# EAGLE design badge Rev B (EAGLE 7.7.0)

## Sheet 1 of 2
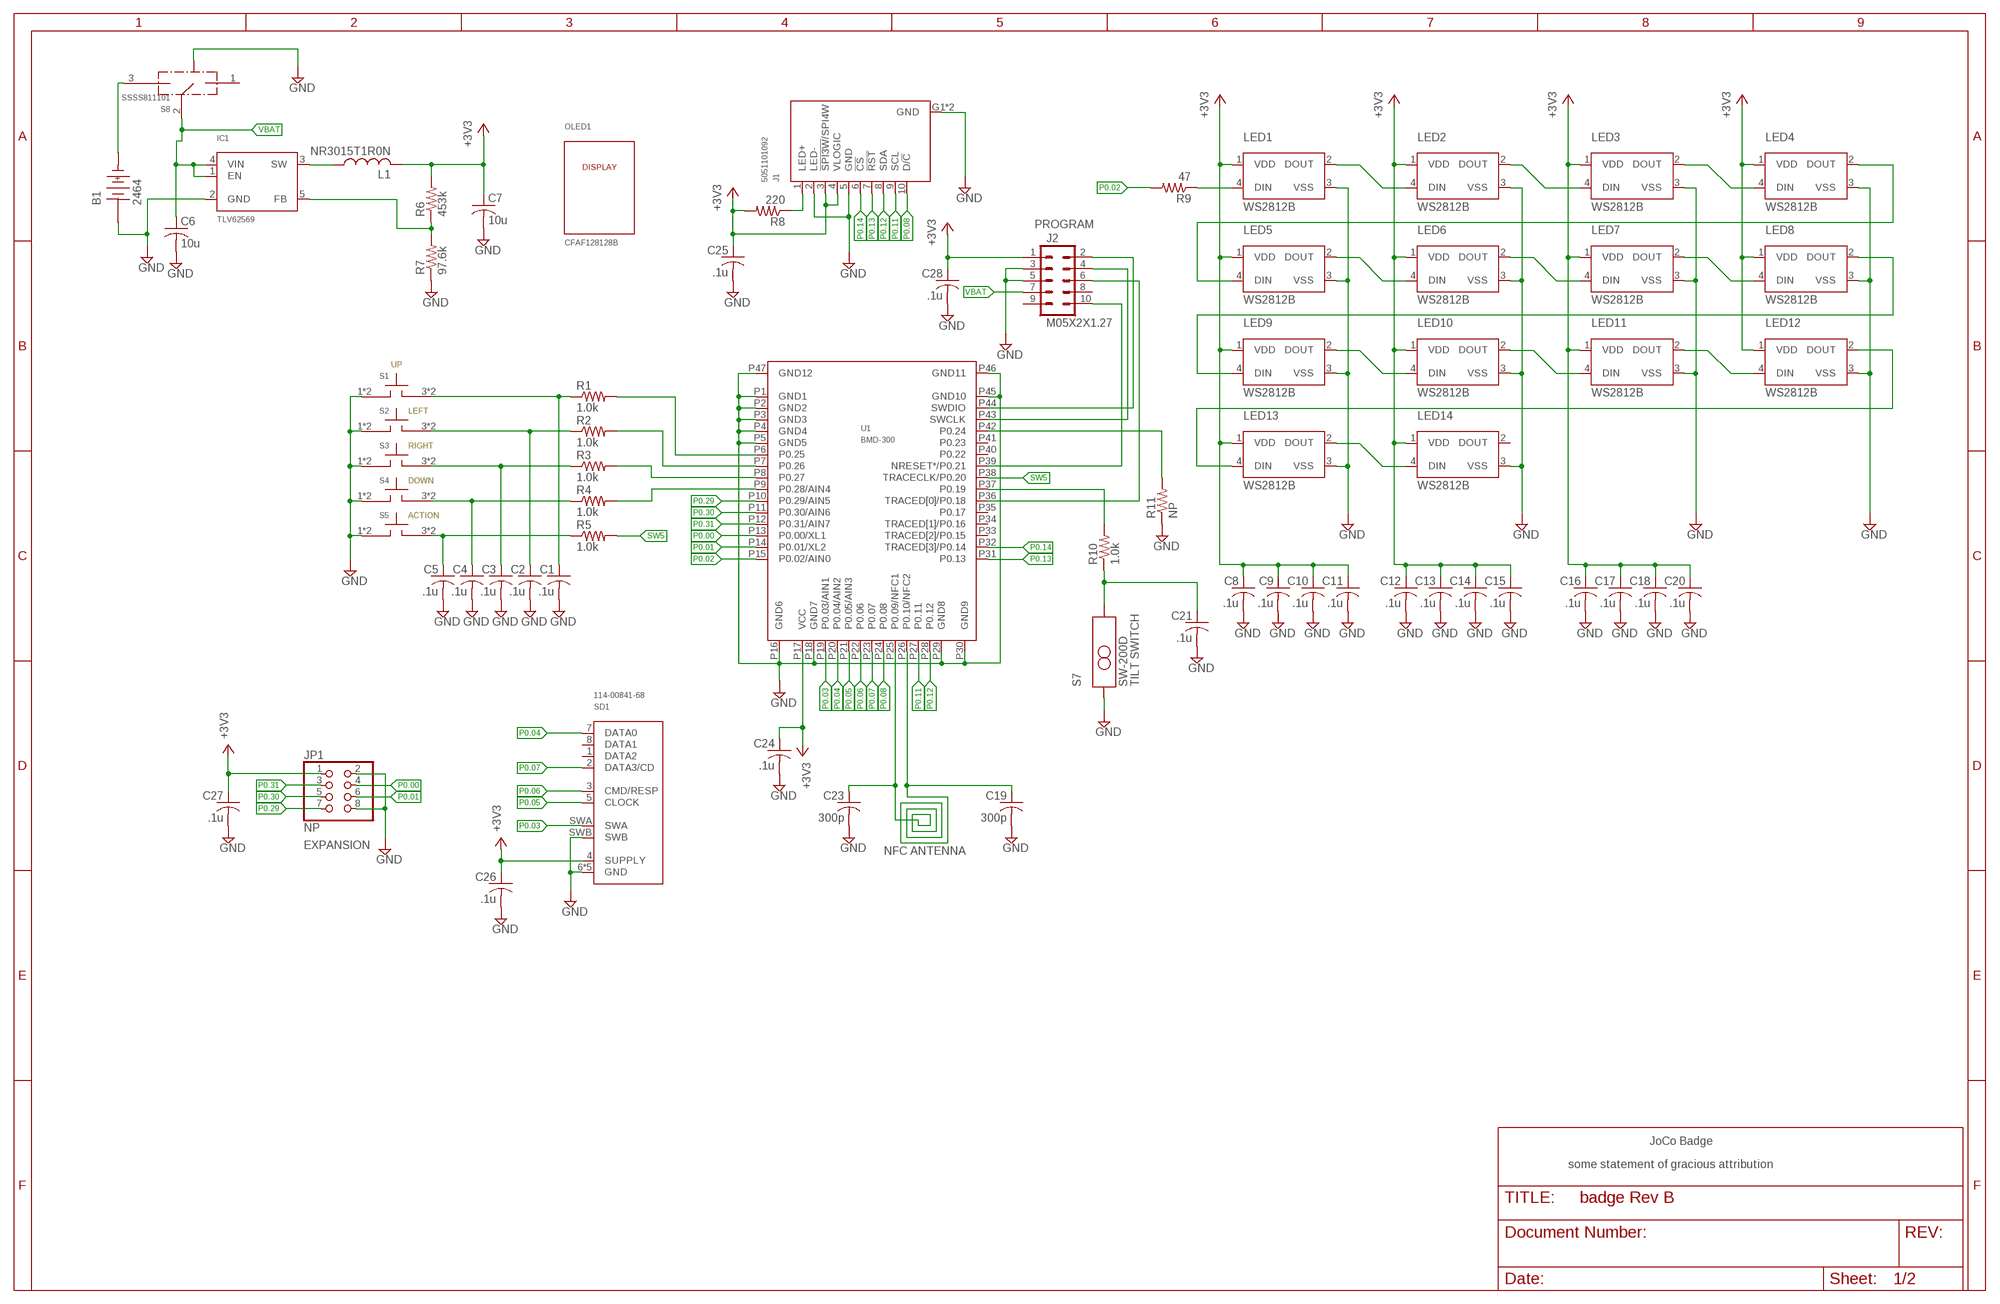
[diagram p0: schematic, sheet 1]

### Parts
B1  2464  [2464]
C1  .1u  C-USC0402K  [C0402K]
C2  .1u  C-USC0402K  [C0402K]
C3  .1u  C-USC0402K  [C0402K]
C4  .1u  C-USC0402K  [C0402K]
C5  .1u  C-USC0402K  [C0402K]
C6  10u  C-USC0805K  [C0805K]
C7  10u  C-USC0805K  [C0805K]
C8  .1u  C-USC0402K  [C0402K]
C9  .1u  C-USC0402K  [C0402K]
C10  .1u  C-USC0402K  [C0402K]
C11  .1u  C-USC0402K  [C0402K]
C12  .1u  C-USC0402K  [C0402K]
C13  .1u  C-USC0402K  [C0402K]
C14  .1u  C-USC0402K  [C0402K]
C15  .1u  C-USC0402K  [C0402K]
C16  .1u  C-USC0402K  [C0402K]
C17  .1u  C-USC0402K  [C0402K]
C18  .1u  C-USC0402K  [C0402K]
C19  300p  C-USC0603K  [C0603K]
C20  .1u  C-USC0402K  [C0402K]
C21  .1u  C-USC0402K  [C0402K]
C23  300p  C-USC0603K  [C0603K]
C24  .1u  C-USC0402K  [C0402K]
C25  .1u  C-USC0402K  [C0402K]
C26  .1u  C-USC0402K  [C0402K]
C27  .1u  C-USC0402K  [C0402K]
C28  .1u  C-USC0402K  [C0402K]
IC1  TLV62569  [DBV-5]
J1  5051101092  [5051101092]
J2  M05X2X1.27  [2X5X1.27]
JP1  NP  PINHD-2X4  [2X04]
L1  NR3015T1R0N  NR3015  [NR3015]
LED1  WS2812B  [WS2812B]
LED2  WS2812B  [WS2812B]
LED3  WS2812B  [WS2812B]
LED4  WS2812B  [WS2812B]
LED5  WS2812B  [WS2812B]
LED6  WS2812B  [WS2812B]
LED7  WS2812B  [WS2812B]
LED8  WS2812B  [WS2812B]
LED9  WS2812B  [WS2812B]
LED10  WS2812B  [WS2812B]
LED11  WS2812B  [WS2812B]
LED12  WS2812B  [WS2812B]
LED13  WS2812B  [WS2812B]
LED14  WS2812B  [WS2812B]
OLED1  CFAF128128B  [CFAF128128B]
R1  1.0k  R-US_R0603  [R0603]
R2  1.0k  R-US_R0603  [R0603]
R3  1.0k  R-US_R0603  [R0603]
R4  1.0k  R-US_R0603  [R0603]
R5  1.0k  R-US_R0603  [R0603]
R6  453k  R-US_R0603  [R0603]
R7  97.6k  R-US_R0603  [R0603]
R8  220  R-US_R0603  [R0603]
R9  47  R-US_R0603  [R0603]
R10  1.0k  R-US_R0603  [R0603]
R11  NP  R-US_R0805  [R0805]
S1  PTS810  [PTS810]
S2  PTS810  [PTS810]
S3  PTS810  [PTS810]
S4  PTS810  [PTS810]
S5  PTS810  [PTS810]
S7  SW-200D  [SW-200D]
S8  SSSS811101  [SSSS811101]
SD1  114-00841-68  [114-00841-68]
U1  BMD-300  [BMD-300]

### Nets
!RESET: J2.10 U1.P39(NRESET*/P0.21)
+3V3: C7.1 C8.1 C9.1 C10.1 C11.1 C12.1 C13.1 C14.1 C15.1 C16.1 C17.1 C18.1 C20.1 C24.1 C25.1 C26.1 C27.1 C28.1 J1.3(!SPI3W!/SPI4W) J1.4(VLOGIC) J2.1 JP1.1 L1.2 LED1.1(VDD) LED2.1(VDD) LED3.1(VDD) LED4.1(VDD) LED5.1(VDD) LED6.1(VDD) LED7.1(VDD) LED8.1(VDD) LED9.1(VDD) LED10.1(VDD) LED11.1(VDD) LED12.1(VDD) LED13.1(VDD) LED14.1(VDD) R6.2 R8.2 SD1.4(SUPPLY) U1.P17(VCC)
ANT: C19.1 C23.1 U1.P25(P0.09/NFC1) U1.P26(P0.10/NFC2)
FB: IC1.5(FB) R6.1 R7.2
GND: B1.- C1.2 C2.2 C3.2 C4.2 C5.2 C6.2 C7.2 C8.2 C9.2 C10.2 C11.2 C12.2 C13.2 C14.2 C15.2 C16.2 C17.2 C18.2 C19.2 C20.2 C21.2 C23.2 C24.2 C25.2 C26.2 C27.2 C28.2 IC1.2(GND) J1.2(LED-) J1.5(GND) J1.G1(GND) J1.G2(GND) J2.3 J2.5 JP1.2 JP1.8 LED1.3(VSS) LED2.3(VSS) LED3.3(VSS) LED4.3(VSS) LED5.3(VSS) LED6.3(VSS) LED7.3(VSS) LED8.3(VSS) LED9.3(VSS) LED10.3(VSS) LED11.3(VSS) LED12.3(VSS) LED13.3(VSS) LED14.3(VSS) R7.1 R11.1 S1.1(A) S1.2(A) S2.1(A) S2.2(A) S3.1(A) S3.2(A) S4.1(A) S4.2(A) S5.1(A) S5.2(A) S7.A S8.G1(GND) S8.G2(GND) S8.G3(GND) S8.G4(GND) SD1.6(GND) SD1.G1(GND) SD1.G2(GND) SD1.G3(GND) SD1.G4(GND) SD1.SWB U1.P1(GND1) U1.P2(GND2) U1.P3(GND3) U1.P4(GND4) U1.P5(GND5) U1.P16(GND6) U1.P18(GND7) U1.P29(GND8) U1.P30(GND9) U1.P45(GND10) U1.P46(GND11) U1.P47(GND12)
N$1: C1.1 R1.1 S1.3(B) S1.4(B)
N$2: C2.1 R2.1 S2.3(B) S2.4(B)
N$3: C3.1 R3.1 S3.3(B) S3.4(B)
N$4: C4.1 R4.1 S4.3(B) S4.4(B)
N$5: C5.1 R5.1 S5.3(B) S5.4(B)
N$6: R1.2 U1.P6(P0.25)
N$7: R2.2 U1.P7(P0.26)
N$8: R3.2 U1.P8(P0.27)
N$9: R4.2 U1.P9(P0.28/AIN4)
N$10: R11.2 U1.P42(P0.24)
N$11: C21.1 R10.1 S7.C
N$13: J1.1(LED+) R8.1
N$15: LED5.2(DOUT) LED6.4(DIN)
N$16: LED9.2(DOUT) LED10.4(DIN)
N$17: LED13.2(DOUT) LED14.4(DIN)
N$18: LED1.2(DOUT) LED2.4(DIN)
N$19: LED6.2(DOUT) LED7.4(DIN)
N$20: LED10.2(DOUT) LED11.4(DIN)
N$22: LED3.2(DOUT) LED4.4(DIN)
N$23: LED7.2(DOUT) LED8.4(DIN)
N$24: LED2.2(DOUT) LED3.4(DIN)
N$25: LED11.2(DOUT) LED12.4(DIN)
N$27: LED4.2(DOUT) LED5.4(DIN)
N$28: LED8.2(DOUT) LED9.4(DIN)
N$29: LED12.2(DOUT) LED13.4(DIN)
N$30: LED1.4(DIN) R9.1
P0.00: JP1.4 U1.P13(P0.00/XL1)
P0.01: JP1.6 U1.P14(P0.01/XL2)
P0.02: R9.2 U1.P15(P0.02/AIN0)
P0.03: SD1.SWA U1.P19(P0.03/AIN1)
P0.04: SD1.7(DATA0) U1.P20(P0.04/AIN2)
P0.05: SD1.5(CLOCK) U1.P21(P0.05/AIN3)
P0.06: SD1.3(CMD/RESP) U1.P22(P0.06)
P0.07: SD1.2(DATA3/CD) U1.P23(P0.07)
P0.08: J1.10(D/!C) U1.P24(P0.08)
P0.11: J1.9(SCL) U1.P27(P0.11)
P0.12: J1.8(SDA) U1.P28(P0.12)
P0.13: J1.7(!RST) U1.P31(P0.13)
P0.14: J1.6(!CS) U1.P32(TRACED[3]/P0.14)
P0.18: J2.6 U1.P36(TRACED[0]/P0.18)
P0.19: R10.2 U1.P37(P0.19)
P0.29: JP1.7 U1.P10(P0.29/AIN5)
P0.30: JP1.5 U1.P11(P0.30/AIN6)
P0.31: JP1.3 U1.P12(P0.31/AIN7)
SW: IC1.3(SW) L1.1
SW5: R5.2 U1.P38(TRACECLK/P0.20)
SWCLK: J2.4 U1.P43(SWCLK)
SWDIO: J2.2 U1.P44(SWDIO)
VBAT: C6.1 IC1.1(EN) IC1.4(VIN) J2.7 S8.2
VIN: B1.+ S8.3
Unconnected: J2.8 J2.9 LED14.2(DOUT) S8.1 SD1.1(DATA2) SD1.8(DATA1) U1.P33(TRACED[2]/P0.15) U1.P34(TRACED[1]/P0.16) U1.P35(P0.17) U1.P40(P0.22) U1.P41(P0.23)

### Notes on the sheet
- PROGRAM
- UP
- LEFT
- RIGHT
- DOWN
- ACTION
- TILT SWITCH
- EXPANSION
- NFC ANTENNA
- JoCo Badge
- some statement of gracious attribution

## Sheet 2 of 2
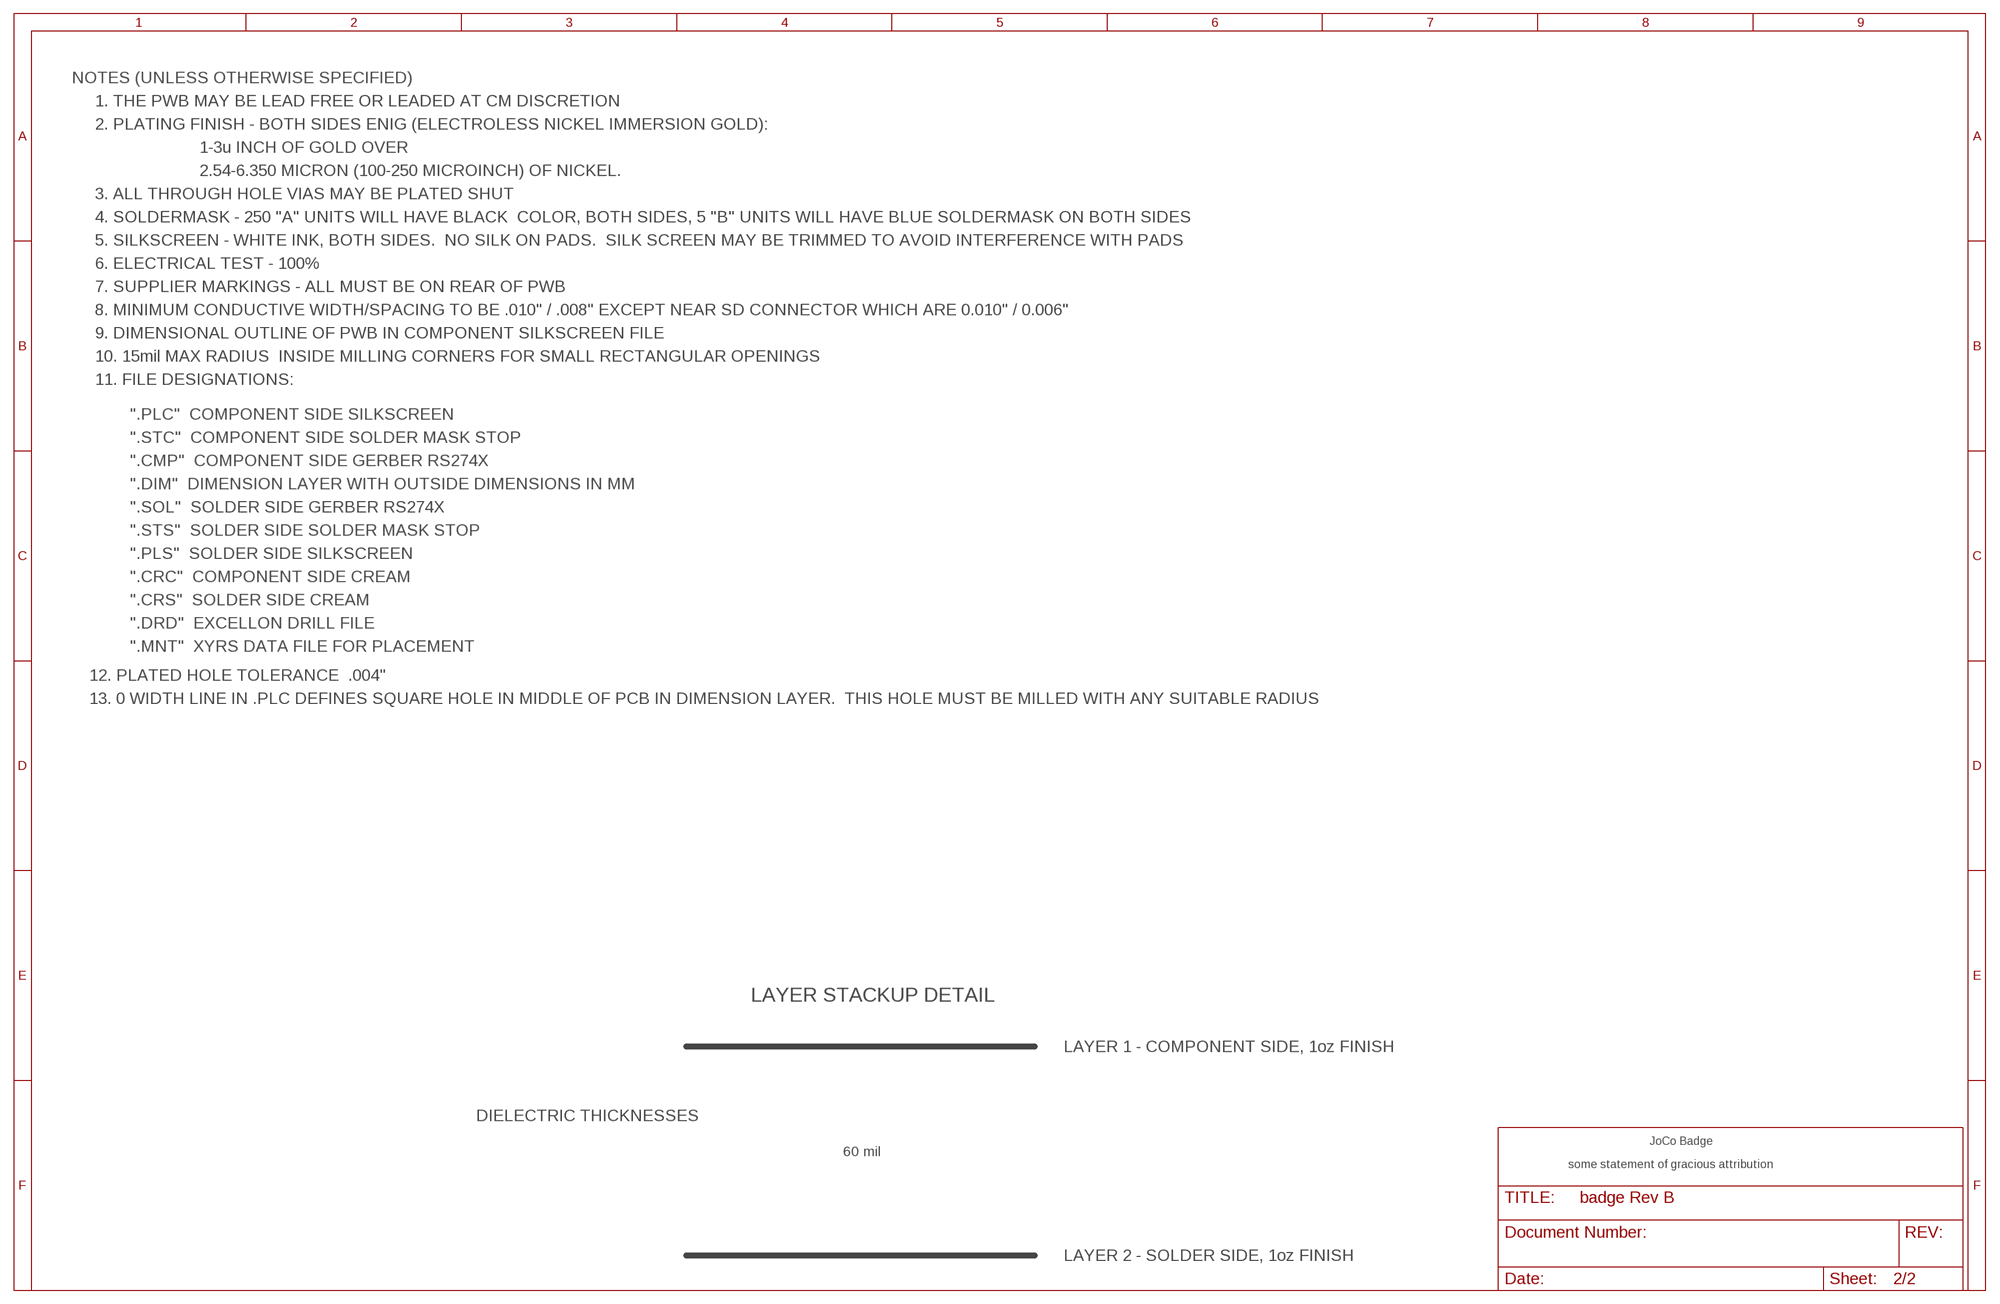
[diagram p1: schematic, sheet 2]

### Notes on the sheet
- NOTES (UNLESS OTHERWISE SPECIFIED)
- 1. THE PWB MAY BE LEAD FREE OR LEADED AT CM DISCRETION
- 2. PLATING FINISH - BOTH SIDES ENIG (ELECTROLESS NICKEL IMMERSION GOLD):
- 1-3u INCH OF GOLD OVER
- 2.54-6.350 MICRON (100-250 MICROINCH) OF NICKEL.
- 3. ALL THROUGH HOLE VIAS MAY BE PLATED SHUT
- 4. SOLDERMASK - 250 "A" UNITS WILL HAVE BLACK  COLOR, BOTH SIDES, 5 "B" UNITS WILL HAVE BLUE SOLDERMASK ON BOTH SIDES
- 5. SILKSCREEN - WHITE INK, BOTH SIDES.  NO SILK ON PADS.  SILK SCREEN MAY BE TRIMMED TO AVOID INTERFERENCE WITH PADS
- 6. ELECTRICAL TEST - 100%
- 7. SUPPLIER MARKINGS - ALL MUST BE ON REAR OF PWB
- 8. MINIMUM CONDUCTIVE WIDTH/SPACING TO BE .010" / .008" EXCEPT NEAR SD CONNECTOR WHICH ARE 0.010" / 0.006"
- 9. DIMENSIONAL OUTLINE OF PWB IN COMPONENT SILKSCREEN FILE
- 10. 15mil MAX RADIUS  INSIDE MILLING CORNERS FOR SMALL RECTANGULAR OPENINGS
- 11. FILE DESIGNATIONS:
- ".PLC"  COMPONENT SIDE SILKSCREEN
- ".STC"  COMPONENT SIDE SOLDER MASK STOP
- ".CMP"  COMPONENT SIDE GERBER RS274X
- ".DIM"  DIMENSION LAYER WITH OUTSIDE DIMENSIONS IN MM
- ".SOL"  SOLDER SIDE GERBER RS274X
- ".STS"  SOLDER SIDE SOLDER MASK STOP
- ".PLS"  SOLDER SIDE SILKSCREEN
- ".CRC"  COMPONENT SIDE CREAM
- ".CRS"  SOLDER SIDE CREAM
- ".DRD"  EXCELLON DRILL FILE
- ".MNT"  XYRS DATA FILE FOR PLACEMENT
- 12. PLATED HOLE TOLERANCE  .004"
- 13. 0 WIDTH LINE IN .PLC DEFINES SQUARE HOLE IN MIDDLE OF PCB IN DIMENSION LAYER.  THIS HOLE MUST BE MILLED WITH ANY SUITABLE RADIUS
- LAYER STACKUP DETAIL
- LAYER 1 - COMPONENT SIDE, 1oz FINISH
- DIELECTRIC THICKNESSES
- JoCo Badge
- 60 mil
- some statement of gracious attribution
- LAYER 2 - SOLDER SIDE, 1oz FINISH

## Library data of the parts
B1 = badge:2464
C1-C5 C8-C21 C23-C28 = rcl:C-US: CAPACITOR, American symbol
C6 C7 = rcl:C-US: CAPACITOR, American symbol; MPN: JMK212BJ106KD-T
IC1 = badge:TLV62569
J1 = badge:5051101092
J2 = badge:M05X2X1.27
JP1 = pinhead:PINHD-2X4: PIN HEADER
L1 = badge:NR3015
LED1-LED14 = badge:WS2812B
OLED1 = badge:CFAF128128B
R1-R11 = rcl:R-US_: RESISTOR, American symbol
S1-S5 = badge:PTS810
S7 = badge:SW-200D
S8 = badge:SSSS811101
SD1 = badge:114-00841-68
U1 = BMD-300:BMD-300

## Board
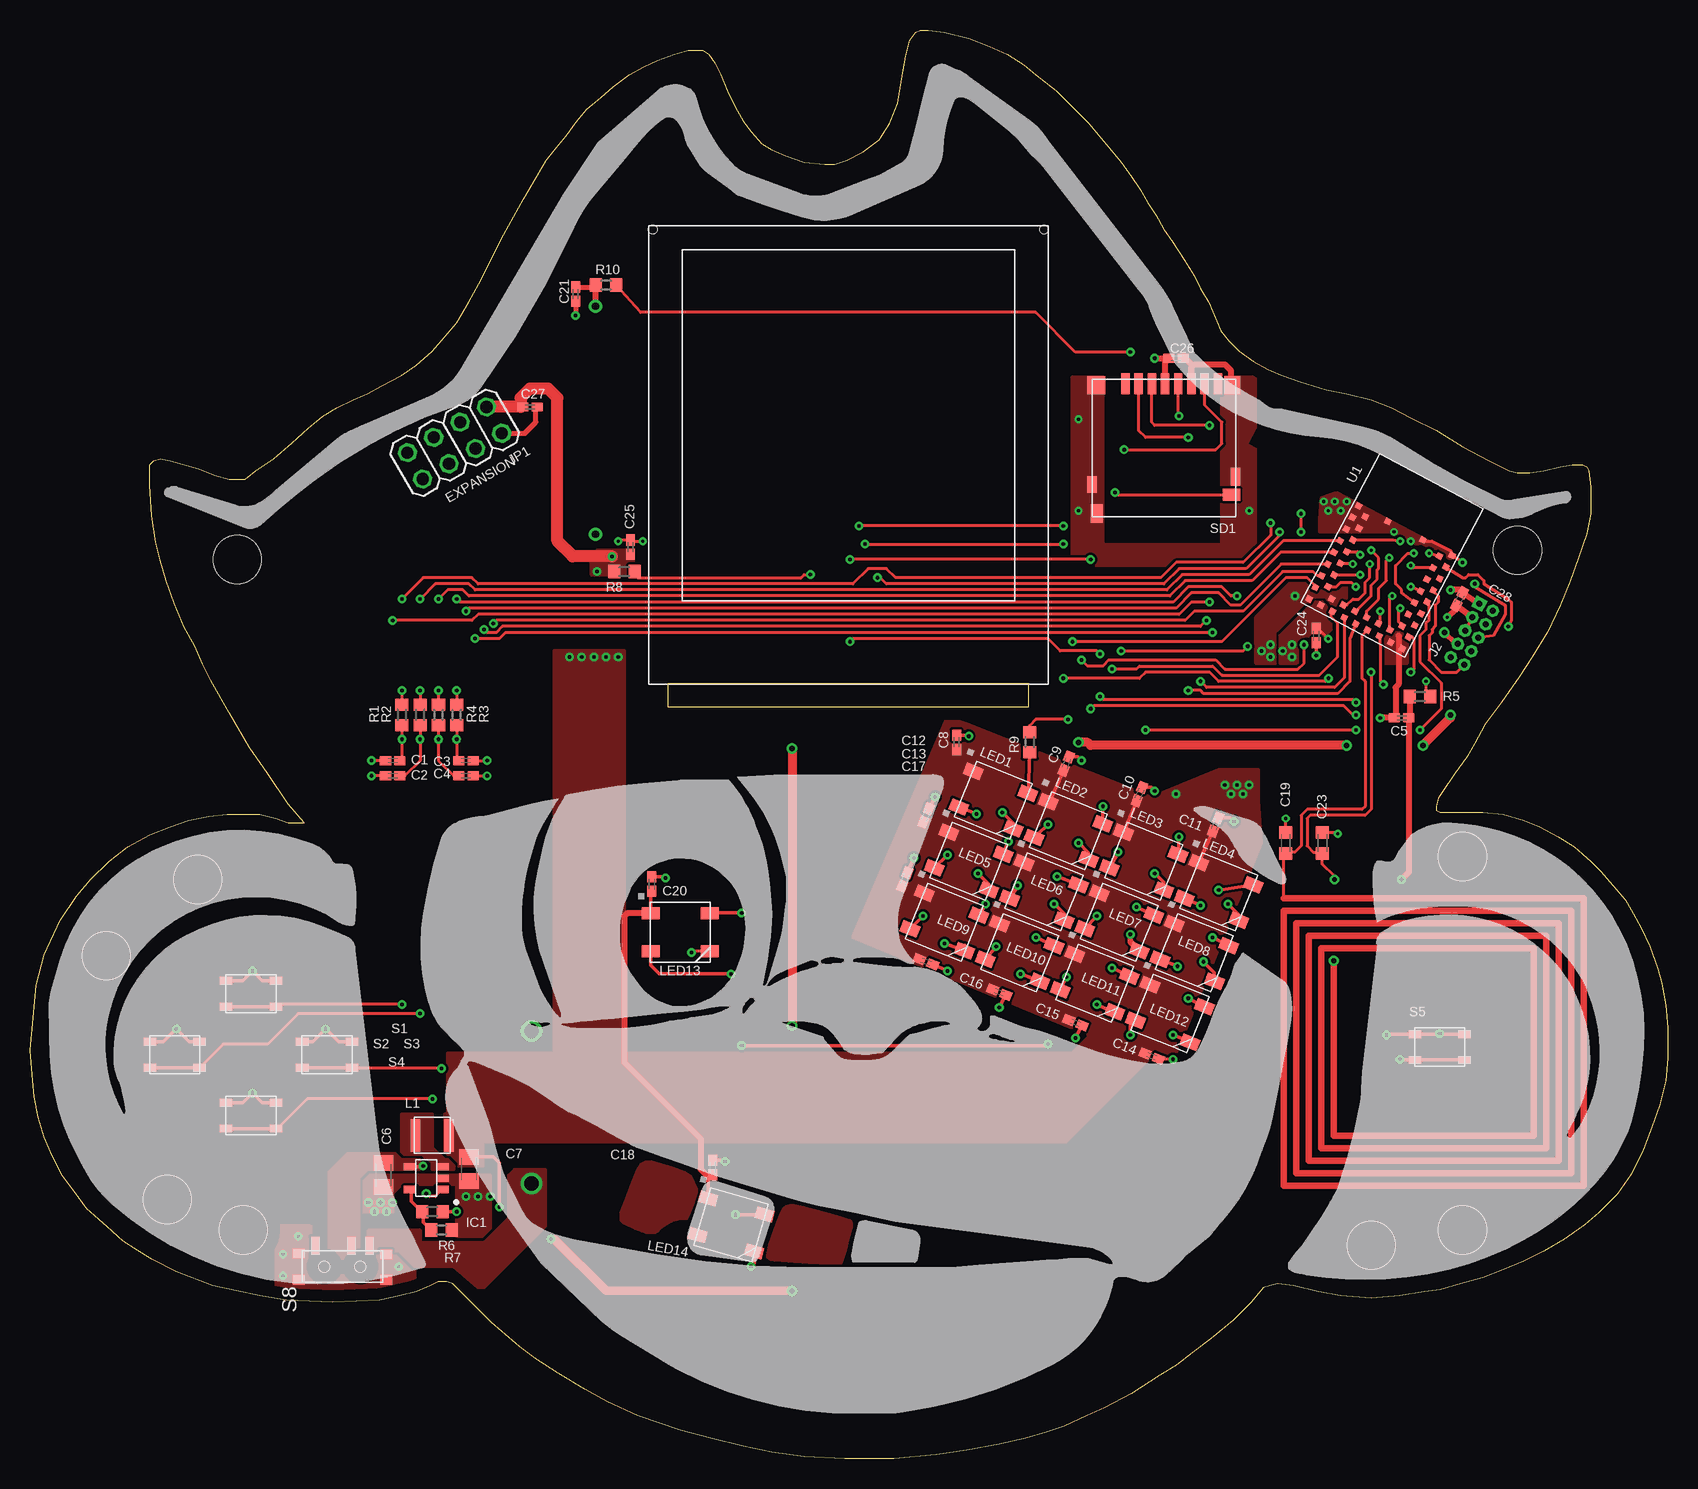
[diagram p2: board, top side]
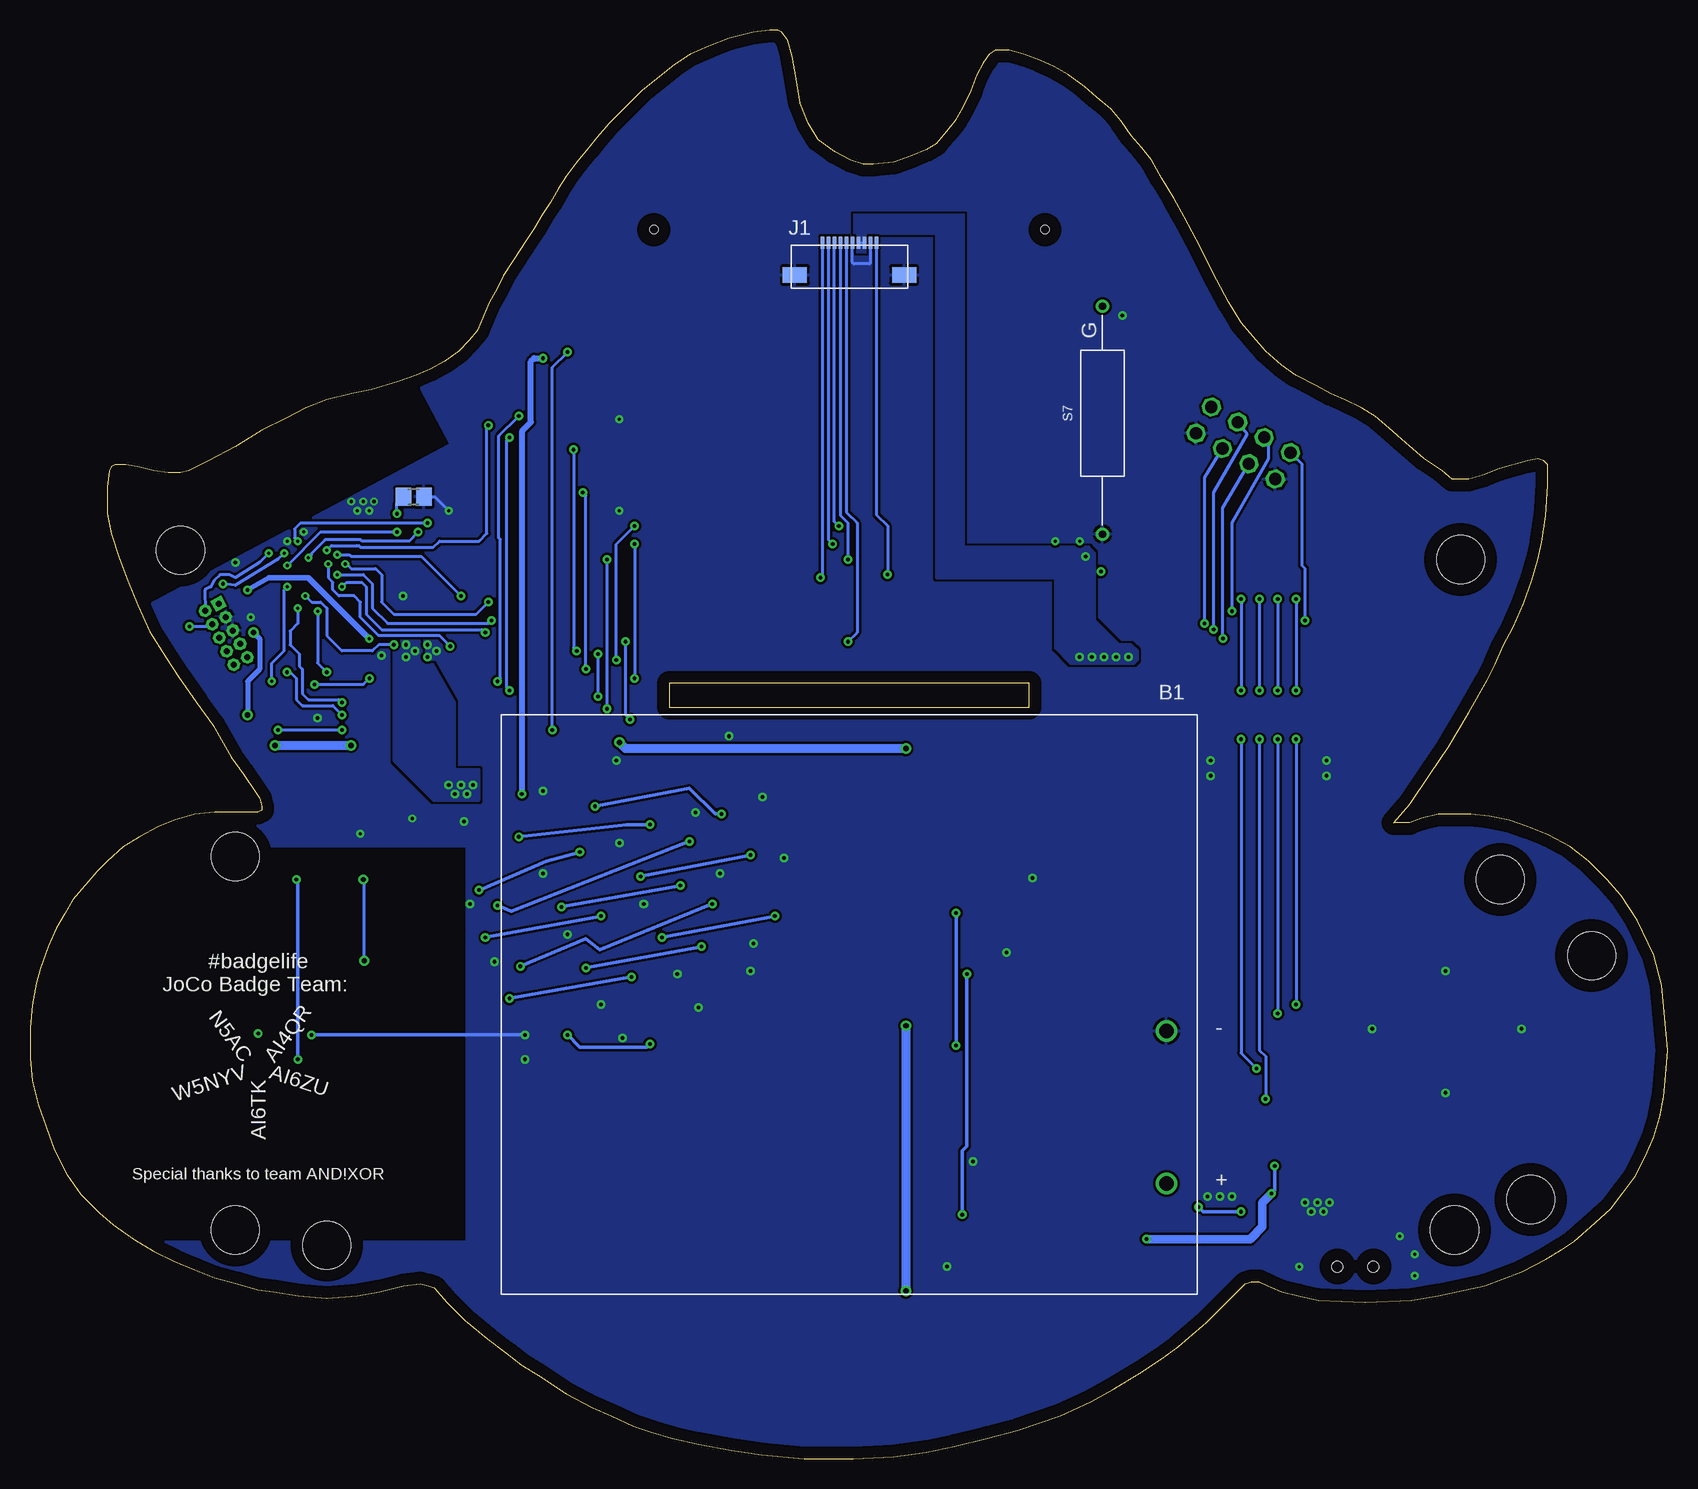
[diagram p3: board, bottom side, seen from below]

Size 136.49 x 119.05 mm. Coordinates in mm from the lower left corner, seen from the top.
Outline: 254 segments
Copper layers (1*16): Top 0.035mm / dielectric 1.5mm / Bottom 0.035mm
Design rules "default *": minimum track width 10mil, minimum drill 10mil, track to track 8mil, track to pad 8mil, pad to pad 8mil, via to via 8mil, smd to smd 8mil, copper to edge 40mil, drill to drill 8mil, minimum pad ring 10mil, minimum via ring 8mil, stop-mask expansion 10mil, vias tented up to drill 12mil, thermal gap 10mil
Holes 4 mm at 17.27,74.93 123.95,75.69 111.76,17.78 17.78,19.05 11.43,21.59 6.35,41.91 13.97,48.26 119.38,19.05 119.38,50.16

### Footprints (pad centres in the part's own frame; a part is rotated, then mirrored left to right if it is on the bottom)
2464 = drill 1.2: + 26.416,-14.922; - 26.416,-2.223
C0402K = smd 0.925 x 0.74: 1 -0.6,0; 2 0.6,0
C0805K = smd 1.3 x 1.6: 1 -1,0; 2 1,0
C0603K = smd 1.05 x 1.08: 1 -0.875,0; 2 0.875,0
DBV-5 = smd 0.6 x 1.05: 1 -0.95,-1.35; 2 0,-1.35; 3 0.95,-1.35; 4 0.95,1.35; 5 -0.95,1.35
5051101092 = smd 0.3 x 1: 1 2.25,0; 2 1.75,0; 3 1.25,0; 4 0.75,0; 5 0.25,0; 6 -0.25,0; 7 -0.75,0; 8 -1.25,0; 9 -1.75,0; 10 -2.25,0 | smd 2 x 1.3: G1 -4.55,-2.7; G2 4.55,-2.7
2X5X1.27 = drill 0.5 square: 1 0,0 | drill 0.5 octagon: 2 1.27,0; 3 0,-1.27; 4 1.27,-1.27; 5 0,-2.54; 6 1.27,-2.54; 7 0,-3.81; 8 1.27,-3.81; 9 0,-5.08; 10 1.27,-5.08
2X04 = drill 1.016 octagon: 1 -3.81,-1.27; 2 -3.81,1.27; 3 -1.27,-1.27; 4 -1.27,1.27; 5 1.27,-1.27; 6 1.27,1.27; 7 3.81,-1.27; 8 3.81,1.27
NR3015 = smd 0.8 x 2.7: 1 -1.4,0; 2 1.4,0
WS2812B = smd 1.5 x 1: 1 -2.45,1.6; 2 -2.45,-1.6; 3 2.45,-1.6; 4 2.45,1.6
CFAF128128B = hole 0.7: -16.3,16.3; 16.3,16.3
R0603 = smd 1 x 1.1: 1 -0.85,0; 2 0.85,0
R0805 = smd 1.3 x 1.5: 1 -0.85,0; 2 0.85,0
PTS810 = smd 1.05 x 0.65: 1 -2.075,1.075; 2 2.075,1.075; 3 -2.075,-1.075; 4 2.075,-1.075
SW-200D = drill 0.6: A -10.09,0; C 8.9,0
SSSS811101 = smd 0.7 x 1.5: 1 -2.25,1.75; 2 0.75,1.75; 3 2.25,1.75 | smd 1 x 0.8: G1 -3.65,1.1; G2 -3.65,-1.1; G3 3.65,1; G4 3.65,-1.1 | hole 0.9: 1.5,0; -1.5,0
114-00841-68 = smd 0.7 x 1.75: 1 3.2,0.875; 2 2.1,0.875; 3 1,0.875; 4 -0.1,0.875; 5 -1.2,0.875; 6 -2.3,0.875; 7 -3.4,0.875; 8 -4.5,0.875 | smd 1.3 x 1.5: G1 -5.7,1 | smd 1.5 x 1.5: G2 5.65,1 | smd 0.8 x 1.5: G3 -5.975,8.6 | smd 0.8 x 1.4: G4 5.975,9.25 | smd 1.45 x 1: SWA -5.625,10.1 | smd 1 x 1.55: SWB 5.575,11.675
BMD-300 = smd 0.5 x 0.5: P1 0.5,9.35; P2 1.4,8.8; P3 0.5,8.25; P4 1.4,7.7; P5 0.5,7.15; P6 1.4,6.6; P7 0.5,6.05; P8 1.4,5.5; P9 0.5,4.95; P10 1.4,4.4; P11 0.5,3.85; P12 1.4,3.3; P13 0.5,2.75; P14 1.4,2.2; P15 0.5,1.65; P16 0.5,0.55; P17 1.6,0.55; P18 2.15,1.45; P19 2.7,0.55; P20 3.25,1.45; P21 3.8,0.55; P22 4.35,1.45; P23 4.9,0.55; P24 5.45,1.45; P25 6,0.55; P26 6.55,1.45; P27 7.1,0.55; P28 7.65,1.45; P29 8.2,0.55; P30 9.3,0.55; P31 9.3,1.65; P32 8.4,2.2; P33 9.3,2.75; P34 8.4,3.3; P35 9.3,3.85; P36 8.4,4.4; P37 9.3,4.95; P38 8.4,5.5; P39 9.3,6.05; P40 8.4,6.6; P41 9.3,7.15; P42 8.4,7.7; P43 9.3,8.25; P44 8.4,8.8; P45 9.3,9.35; P46 6.55,9.35; P47 3.25,9.35

### Placement (x,y rotation side)
B1  68.2,37.85 0 bottom
C1  30.23,58.17 180 top
C2  30.23,56.9 180 top
C3  36.32,58.17 0 top
C4  36.32,56.9 0 top
C5  114.3,61.72 180 top
C6  29.46,23.62 270 top
C7  36.58,24.13 270 top
C8  77.22,59.69 90 top
C9  86.36,57.91 68 top
C10  92.46,55.37 68 top
C11  98.81,52.83 68 top
C12  74.68,53.59 68 top
C13  72.9,48.26 68 top
C14  93.47,33.53 338 top
C15  87.12,36.32 338 top
C16  80.77,38.86 338 top
C17  74.68,41.4 338 top
C18  56.9,24.26 90 top
C19  104.65,51.31 90 top
C20  51.82,47.88 90 top
C21  45.47,97.03 270 top
C23  107.7,51.31 90 top
C24  107.19,68.58 270 top
C25  50.04,75.95 90 top
C26  95.5,91.69 0 top
C27  41.67,87.63 0 top
C28  119.13,71.63 242 top
IC1  33.02,23.37 90 top
J1  68.2,101.33 0 bottom
J2  120.78,71.25 332 top
JP1  35.38,84.63 210 top
L1  33.53,26.92 0 top
LED1  80.27,54.87 338 top
LED2  86.53,52.33 338 top
LED3  92.8,49.79 338 top
LED4  99.06,47.25 338 top
LED5  78.24,49.79 338 top
LED6  84.5,47.25 338 top
LED7  90.77,44.71 338 top
LED8  97.03,42.17 338 top
LED9  76.2,44.71 338 top
LED10  82.47,42.17 338 top
LED11  88.74,39.63 338 top
LED12  95,37.09 338 top
LED13  54.19,43.86 0 top
LED14  58.42,19.47 344 top
OLED1  68.2,86.11 0 top
R1  30.99,61.98 90 top
R2  32.51,61.98 90 top
R3  35.56,61.98 90 top
R4  34.04,61.98 90 top
R5  115.82,63.5 0 top
R6  33.53,20.57 0 top
R7  34.29,19.05 180 top
R8  49.53,73.91 180 top
R9  83.31,59.69 90 top
R10  48.01,97.79 0 top
R11  104.52,80.14 180 bottom
S1  18.41,38.73 0 top
S2  12.06,33.66 0 top
S3  24.77,33.66 0 top
S4  18.41,28.57 0 top
S5  117.47,34.29 0 top
S7  47.12,87.12 90 bottom
S8  26.04,16 0 top
SD1  94.49,90.42 180 top
U1  105.9,71.38 332 top

### Tracks (layer width: path | path; a pad name or v marks a point on that pad's centre or on a via)
!RESET
  Top 0.254: U1.P39 116.95,72.28 117.35,71.88 117.35,71.37 117.09,71.12 117.09,69.34 116.84,69.09 116.84,68.83 116.59,68.58 116.59,66.55 117.6,65.53 118.88,65.53 J2.10
+3V3  (via drill 0.25, 0.3)
  Top 0.254: v108.2,68.33 107.44,69.09 107.28,69.09 C24.1
  Top 0.305: R6.2 v35.56,20.57 | v39.12,20.95 39.12,24.64 38.61,25.15 36.59,25.15 C7.1 | LED14.1 56.51,23.27 56.62,23.39 C18.1 | C9.1 84.84,54.48 LED2.1 | C10.1 LED3.1 | C11.1 LED4.1 | LED13.1 51.74,47.2 C20.1 | 106.97,68.96 C24.1
  Top 0.406: 40.89,87.64 C27.1
  Top 0.508: J2.1 C28.1 119.17,72.39 v118.36,72.39 | LED13.1 49.78,45.46 49.53,45.21 49.53,33.02 55.88,26.67 55.88,24.13 56.62,23.39 | SD1.4 94.59,91.38 94.82,91.61 | 94.82,91.61 C26.1 | v93.73,91.69 94.74,91.69 94.82,91.61
  Top 1.016: v48.51,75.18 45.21,75.18 43.94,76.45 43.94,88.39 43.18,89.15 41.66,89.15 40.89,88.39 40.89,87.64 JP1.1
  Bottom 0.254: J1.4 J1.3
  Bottom 0.305: v35.56,20.57 38.73,20.57 v39.12,20.95
  Bottom 0.457: v118.36,72.39 116.59,73.41 113.28,73.41 v108.2,68.33
  Bottom 0.508: v95.5,55.37 95.5,85.6 94.74,86.36 94.74,91.44 94.49,91.69 v93.73,91.69
  other vias: 105.16,67.82 105.16,66.8 104.39,67.31 99.57,56.13 100.58,56.13 101.6,56.13 100.08,55.37 101.09,55.37 47.24,73.91 44.96,66.8 45.97,66.8 46.99,66.8 48.01,66.8 49.02,66.8
  pour Top (rank 4, no thermals): 34.54,25.53 34.54,28.7 37.72,28.7 37.72,24.38 35.69,24.38
  pour Top (rank 4, no thermals): 77.98,61.21 93.47,55.12 99.06,57.4 102.36,57.4 102.36,54.86 102.62,51.31 95,32.51 68.58,43.43 76.45,61.72
  pour Top (no thermals): 34.8,26.42 86.36,26.42 93.47,33.53 88.65,35.56 86.87,33.78 49.53,33.78 49.53,67.31 43.69,67.31 43.69,33.78 34.8,33.78
  pour Top (no thermals): 108.46,69.09 108.46,70.61 107.95,71.12 107.7,71.37 107.44,71.37 106.93,71.37 104.14,68.58 104.14,66.29 105.66,66.29 105.66,68.07 106.17,68.58 107.95,68.58
  pour Bottom (no thermals): 106.17,68.33 106.17,58.17 102.87,54.86 99.06,54.86 99.06,57.4 101.09,57.4 101.09,62.99 104.14,68.33
  pour Bottom (rank 3, no thermals): 51.05,73.41 51.05,67.56 49.78,66.29 44.45,66.29 44.2,66.55 44.2,67.31 44.7,67.82 45.72,67.82 47.75,69.85 47.75,75.44 48.26,75.95 58.67,75.95 58.67,103.62 67.82,103.62 67.82,100.57 66.8,100.57 66.8,102.09 60.96,102.09 60.96,73.41
  pour Top (rank 5, no thermals): 50.29,75.69 47.24,75.69 46.74,75.18 46.74,73.66 50.29,73.66
ANT  (via drill 0.25, 0.3, 0.41)
  Top 0.254: 104.47,46.69 104.47,50.26 C19.1 104.76,50.55 105.41,50.55 105.92,51.05 105.92,53.59 106.43,54.1 111,54.1 111.25,54.36 111.25,64.77 111,65.02 111,68.58 111.45,69.03 U1.P25 | U1.P26 112.52,69.74 v112.52,70.61 | v111.76,65.53 111.76,54.1 111.25,53.59 106.68,53.59 106.43,53.34 106.43,51.05 106.93,50.55 107.58,50.55 C23.1 107.7,49.53 108.71,48.51 v108.71,48.26
  Top 0.533: 104.47,46.69 129.46,46.69 129.46,22.73 104.47,22.73 104.47,45.64 128.42,45.64 128.42,23.77 105.51,23.77 105.51,44.6 127.38,44.6 127.38,24.82 106.55,24.82 106.55,43.56 126.34,43.56 126.34,25.86 107.59,25.86 107.59,42.52 125.3,42.52 125.3,26.9 108.64,26.9 v108.64,41.48
  Bottom 0.254: v108.64,41.48 108.64,48.18 v108.71,48.26 | v112.52,70.61 112.52,66.29 v111.76,65.53
FB
  Top 0.305: R7.2 33.4,19.05 32.77,19.68 32.77,20.49 R6.1 32.64,20.57 31.75,21.46 31.75,22.34 IC1.5
GND  (via drill 0.25, 0.3)
  Top 0.254: C19.2 v104.65,53.34 | C23.2 108.85,52.18 v108.97,52.07 | J2.3 J2.5 | C28.2 118.84,70.84 | C25.2 49.11,76.55 v49.02,76.45 | 50.04,76.45 v51.05,76.45 | C1.2 v28.45,58.17 | C2.2 v28.45,56.9 | C3.2 v38.1,58.17 | C4.2 v38.1,56.9 | LED13.3 55.21,42.26 v55.12,42.16 | U1.P46 116.17,76.45 116.84,76.45 118.36,75.69 U1.P45 v119.38,74.68
  Top 0.305: LED1.3 81.94,52.93 v81.03,53.85 | LED5.3 79.91,47.85 v78.99,48.77 | 77.88,42.77 LED9.3 v76.2,42.93 | 84.14,40.06 LED10.3 v82.55,40.39 | LED6.3 86.17,45.4 v85.34,46.23 | LED2.3 88.21,50.48 v87.38,51.31 | LED3.3 94.47,48.02 v93.73,48.77 | LED4.3 100.74,45.31 v99.82,46.23 | LED8.3 98.7,40.49 v97.79,41.4 | C8.2 78.14,60.29 v78.23,60.2 | C9.2 87.33,58.47 v87.63,58.17 | C10.2 93.42,55.93 v93.73,55.63 | C11.2 100.03,53.39 v100.33,53.09 | v75.44,55.12 C12.2 | C13.2 v73.66,50.04 | C17.2 v76.45,40.64 | C16.2 v80.77,37.59 | C15.2 v87.12,35.05 | C14.2 v95.25,33.27 | S2.1 11.11,34.73 v12.19,35.81 13.28,34.73 S2.2 | S1.1 17.71,39.81 v18.54,40.64 19.37,39.81 S1.2 | S3.1 23.55,34.73 v24.64,35.81 25.72,34.73 S3.2 | S4.1 17.71,29.65 v18.54,30.48 19.37,29.65 S4.2 | LED14.3 60.34,16.27 v60.07,16 | C18.2 57.82,24.86 v57.91,24.77 | C20.2 52.87,48.48 v52.96,48.39 | S5.2 117.54,35.37 v117.47,35.43 117.41,35.37 S5.1 113.09,35.37 v113.03,35.31 | v88.9,37.85 90.42,37.08 LED11.3 | v95.25,35.31 LED12.3 | C24.2 v107.19,66.93
  Top 0.406: U1.P18 | C21.2 v45.47,95.25 | JP1.2 41.24,85.44 42.16,86.36 42.16,87.52 C27.2
  Top 0.457: v91.69,43.69 91.69,43.05 LED7.3
  Top 0.508: C28.2 J2.3 | 118.84,70.84 v118.11,70.1 | 114.05,68.58 114.05,64.52 113.79,64.26 113.79,61.81 C5.2 v112.52,61.72 | C26.2 96.27,91.69 96.77,91.19 96.77,89.56 SD1.6 96.79,90.95 97.03,91.19 99.57,91.19 100.08,90.68 100.08,89.54 SD1.G1
  Bottom 0.254: J1.2 66.45,99.65 66.55,99.55 67.82,99.55 67.95,99.68 J1.5 | R11.1 102.74,80.14 v101.6,78.99
  Bottom 0.305: v113.03,35.31 v95.25,35.31
  other vias: 109.73,79.76 109.22,78.99 107.82,79.76 108.2,78.99 108.71,79.76 113.67,77.22 115.06,76.45 87.38,86.61 87.38,78.99 28.19,21.34 29.21,21.34 30.23,21.34 29.72,20.57 28.7,20.57 36.32,21.84 37.34,21.84 38.35,21.84 105.41,71.88 103.38,67.82 103.38,66.8 102.62,67.31 22.35,18.54 21.08,17.02 21.08,15.24 30.73,16
  pour Bottom (rank 6): -2.03,126.75 104.65,126.75 104.65,90.17 101.6,84.58 127.76,70.61 127.76,51.05 100.08,51.05 100.08,18.03 133.1,18.03 123.19,8.13 103.63,8.13 91.95,-3.56 24.38,-3.56 -2.03,22.86
  pour Top (no thermals): 107.44,77.22 113.67,77.22 115.57,76.2 116.59,76.45 111.76,78.99 108.97,80.52 107.57,80.01 107.44,78.23
  pour Top (no thermals): 86.87,90.17 89.41,90.17 89.41,76.2 99.31,76.2 99.31,90.17 102.11,90.17 102.11,74.42 86.87,74.42
  pour Top (rank 3, no thermals): 27.69,20.57 27.69,23.11 28.19,23.62 38.35,23.62 38.35,18.54 35.56,18.54 35.56,22.86 30.99,22.86 30.23,22.1 30.23,20.57
  pour Top (rank 2, no thermals): 109.73,72.9 104.9,72.9 102.11,70.1 102.11,66.29 104.14,66.29 104.14,68.58 106.93,71.37 107.7,71.37 108.2,70.87 109.22,70.87 109.47,70.87 109.73,71.12
  pour Top (rank 5, no thermals): 114.05,68.83 112.78,68.83 112.78,66.29 114.81,66.29 114.81,68.83
  pour Top (rank 5, no thermals): 116.33,76.71 118.36,75.69 118.62,75.18 118.36,74.93 116.08,76.2
  pour Top (rank 3, no thermals): 20.57,14.22 32,14.22 32,17.53 23.37,17.53 23.37,19.3 20.57,19.3
N$1  (via drill 0.3)
  Top 0.254: R1.1 v30.99,59.94 30.99,58.33 C1.1 | v30.99,37.85 20.68,37.85 S1.4
  Top 0.305: S1.3 S1.4
  Bottom 0.254: v30.99,59.94 v30.99,37.85
N$2  (via drill 0.3)
  Top 0.254: R2.1 v32.51,59.94 32.51,58.17 31.24,56.9 C2.1 | v32.51,37.08 22.35,37.08 19.81,34.54 16.1,34.54 S2.4
  Top 0.305: S2.3 S2.4
  Bottom 0.254: v32.51,59.94 v32.51,37.08
N$3  (via drill 0.3)
  Top 0.254: R3.1 v35.56,59.94 35.56,58.33 C3.1 | v34.29,32.51 26.91,32.51 S3.4
  Top 0.305: S3.3 S3.4
  Bottom 0.254: v35.56,59.94 35.56,33.78 v34.29,32.51
N$4  (via drill 0.3)
  Top 0.254: R4.1 v34.04,59.94 34.04,58.17 35.31,56.9 C4.1 | v33.53,29.97 23.11,29.97 20.57,27.43
  Top 0.305: S4.3 S4.4 | S4.4 20.51,27.5 20.57,27.43 20.56,27.43 S4.4
  Bottom 0.254: v34.04,59.94 34.04,34.04 33.53,33.53 v33.53,29.97
N$5  (via drill 0.3)
  Top 0.305: S5.4 S5.3 114.23,33.22 v114.17,33.27
  Top 0.508: R5.1 114.97,61.8 C5.1 114.9,48.86 v114.3,48.26
  Bottom 0.305: v114.17,33.27 114.17,48.13 v114.3,48.26
N$6  (via drill 0.25, 0.3)
  Top 0.254: U1.P6 113.57,76.55 v114.17,76.45 | v103.38,77.98 103.38,76.96 101.09,74.68 95.5,74.68 94.23,73.41 72.14,73.41 71.37,74.17 69.85,74.17 68.58,72.9 37.34,72.9 36.83,73.41 32.77,73.41 v30.99,71.63 | v30.99,64.01 R1.2
  Bottom 0.254: v103.38,77.98 113.92,77.98 114.43,77.47 114.43,76.71 v114.17,76.45 | v30.99,71.63 v30.99,64.01
N$7  (via drill 0.3)
  Top 0.254: U1.P7 104.42,76.48 101.6,73.66 96.01,73.66 94.74,72.39 37.08,72.39 36.58,72.9 33.78,72.9 v32.51,71.63 | v32.51,64.01 R2.2
  Bottom 0.254: v32.51,71.63 v32.51,64.01
N$8  (via drill 0.25, 0.3)
  Top 0.254: U1.P8 110.61,75.58 v110.87,75.31 | v100.58,71.88 100.08,71.88 99.31,72.64 96.52,72.64 95.25,71.37 35.81,71.37 v35.56,71.63 | v35.56,64.01 R3.2
  Bottom 0.254: v100.58,71.88 103.89,75.18 109.73,75.18 109.86,75.31 v110.87,75.31 | v35.56,71.63 v35.56,64.01
N$9  (via drill 0.3)
  Top 0.254: U1.P9 104.22,75.51 101.85,73.15 96.27,73.15 95,71.88 36.58,71.88 36.07,72.39 34.8,72.39 v34.04,71.63 | v34.04,64.01 R4.2
  Bottom 0.254: v34.04,71.63 v34.04,64.01
N$10  (via drill 0.25, 0.3)
  Top 0.254: U1.P42 115.25,74.23 v115.06,74.42 | v105.92,77.22 v105.92,78.74
  Bottom 0.254: v115.06,74.42 112.27,77.22 v105.92,77.22 | v105.92,78.74 105.92,79.59 R11.2
N$11
  Top 0.406: C21.1 47.16,97.63 R10.1
  Top 0.508: R10.1 47.12,97.75 S7.C
  Bottom 0.406: S7.C 47.16,96.02
N$13  (via drill 0.3)
  Top 0.254: R8.1 50.63,73.41 64.26,73.41 64.52,73.66 v65.02,73.66
  Bottom 0.254: J1.1 65.95,78.65 65.02,77.72 v65.02,73.66
N$15  (via drill 0.3)
  Top 0.305: LED5.2 v76.45,50.29 | v85.6,48.51 LED6.4
  Bottom 0.305: v76.45,50.29 v85.6,48.51
N$16  (via drill 0.3)
  Top 0.305: LED9.2 v74.42,45.21 | v83.82,43.43 LED10.4
  Bottom 0.305: v74.42,45.21 v83.82,43.43
N$17  (via drill 0.3)
  Top 0.305: LED13.2 51.74,41.1 52.45,40.39 v58.42,40.39 | v58.8,20.32 61.2,20.32 LED14.4
  Bottom 0.305: v58.42,40.39 58.42,26.04 58.8,25.65 v58.8,20.32
N$18  (via drill 0.3)
  Top 0.305: LED1.2 v78.87,53.72 | LED2.4 v89.41,54.35 v89.41,54.36
  Bottom 0.305: v78.87,53.72 79.38,53.72 81.53,55.88 v89.41,54.36
N$19  (via drill 0.3)
  Top 0.305: LED6.2 v82.3,47.75 | v92.2,45.97 LED7.4
  Bottom 0.305: v82.3,47.75 v92.2,45.97
N$20  (via drill 0.3)
  Top 0.305: LED10.2 v80.52,42.67 | v90.17,40.89 LED11.4
  Bottom 0.305: v80.52,42.67 v90.17,40.89
N$22  (via drill 0.3)
  Top 0.305: v99.06,47.37 LED4.4 | LED3.2 v90.68,50.55
  Bottom 0.305: v99.06,47.37 93.47,49.78 v90.68,50.55
N$23  (via drill 0.3)
  Top 0.305: LED7.2 v88.9,45.21 | v98.55,43.43 LED8.4
  Bottom 0.305: v88.9,45.21 v98.55,43.43
N$24  (via drill 0.3)
  Top 0.305: LED3.4 v95.76,51.82 | LED2.2 v84.84,52.83
  Bottom 0.305: v95.76,51.82 86.74,52.83 v84.84,52.83
N$25  (via drill 0.3)
  Top 0.305: LED11.2 v86.36,40.13 | v96.52,38.35 LED12.4
  Bottom 0.305: v86.36,40.13 v96.52,38.35
N$27  (via drill 0.3)
  Top 0.305: LED4.2 v97.54,46.1 | v81.53,51.44 LED5.4
  Bottom 0.305: v97.54,46.1 96.39,45.59 v81.53,51.44
N$28  (via drill 0.3)
  Top 0.305: LED8.2 v95.63,41.02 | v79.63,46.23 LED9.4
  Bottom 0.305: v95.63,41.02 90.17,43.31 89.03,42.42 v79.63,46.23
N$29  (via drill 0.3)
  Top 0.305: v59.31,45.47 LED13.4 | v59.31,34.42 84.71,34.42 v84.84,34.54 | v91.69,35.31 91.69,36.08 LED12.2
  Bottom 0.305: v59.31,34.42 v59.31,45.47 | v84.84,34.54 85.09,34.29 90.68,34.29 v91.69,35.31
N$30
  Top 0.305: R9.1 83.19,55.37 LED1.4
P0.00  (via drill 0.3)
  Top 0.254: U1.P13 107.28,73.57 106.93,73.91 104.39,73.91 101.09,70.61 97.03,70.61 96.27,69.85 38.86,69.85 v38.61,69.6
  Bottom 0.254: JP1.4 38.59,81.78 38.61,81.76 v38.61,69.6
P0.01  (via drill 0.25, 0.3)
  Top 0.254: U1.P14 108.86,72.66 109.22,73.03 110.11,73.03 v110.49,72.64 | v98.55,68.83 39.62,68.83 39.12,68.33 v37.08,68.33
  Bottom 0.254: v110.49,72.64 110.11,73.03 108.84,73.03 108.46,72.64 108.46,70.36 107.19,69.09 98.81,69.09 v98.55,68.83 | JP1.6 37.08,79.25 v37.08,68.33
P0.02  (via drill 0.3)
  Top 0.254: v86.49,61.59 83.82,61.59 83.31,61.09 R9.2 | v86.87,68.07 99.31,68.07 104.65,73.41 106.43,73.41 107.11,72.72 U1.P15
  Bottom 0.254: v86.87,68.07 86.87,61.98 v86.49,61.59
P0.03  (via drill 0.3)
  Top 0.254: U1.P19 108.46,70.52 108.46,70.1 108.97,69.6 108.97,66.8 107.44,65.28 99.31,65.28 98.55,66.04 92.46,66.04 92.2,65.79 v90.17,65.79 | v90.42,80.52 90.62,80.32 SD1.SWA
  Bottom 0.254: v90.17,65.79 90.17,80.26 v90.42,80.52
P0.04  (via drill 0.25, 0.3)
  Top 0.254: U1.P20 109.74,71.13 110.24,71.63 110.74,71.63 111.25,72.14 111.25,73.03 111.63,73.41 v111.63,74.55 | v90.93,67.31 101.09,67.31 v101.47,67.69 | v91.19,84.07 98.81,84.07 99.31,84.58 99.31,86.36 97.89,87.79 SD1.7
  Bottom 0.254: v111.63,74.55 111.63,73.41 111.25,73.03 111.25,72.39 110.74,71.88 109.47,71.88 108.97,71.37 108.97,70.1 107.44,68.58 102.36,68.58 v101.47,67.69 | v91.19,84.07 91.19,67.56 v90.93,67.31
P0.05  (via drill 0.3)
  Top 0.254: U1.P21 109.51,65.06 108.71,64.26 98.04,64.26 v97.54,64.77 | v95.76,86.87 95.69,86.94 SD1.5
  Bottom 0.254: v97.54,64.77 97.28,65.02 97.28,76.58 97.41,76.71 97.41,85.22 v95.76,86.87
P0.06  (via drill 0.25, 0.3)
  Top 0.254: U1.P22 110.49,70.62 111.76,71.88 111.76,72.77 112.27,73.28 112.27,74.04 112.39,74.17 112.39,75.06 v111.76,75.69 | SD1.3 93.47,89.53 93.47,86.36 93.73,86.11 v98.3,86.11
  Bottom 0.254: v111.76,75.69 111.38,76.07 109.22,76.07 109.09,76.07 108.97,75.95 102.87,75.95 102.36,76.45 99.06,76.45 98.42,77.09 98.42,85.98 v98.3,86.11
P0.07  (via drill 0.3)
  Top 0.254: v96.52,64.01 97.54,64.01 97.79,63.75 108.97,63.75 109.98,64.77 109.98,68.33 U1.P23 | v96.52,85.09 92.96,85.09 92.39,85.67 SD1.2
  Bottom 0.254: v96.52,64.01 96.77,64.26 96.77,84.84 v96.52,85.09
P0.08  (via drill 0.25, 0.3)
  Top 0.254: U1.P24 111.39,70.62 112.39,71.63 112.39,72.52 113.03,73.15 113.03,74.8 v113.28,75.06 | v104.14,77.22 104.14,76.96 101.35,74.17 95.76,74.17 94.49,72.9 71.37,72.9 70.87,73.41 v70.61,73.41
  Bottom 0.254: v113.28,75.06 113.03,75.31 113.03,75.44 111.89,76.58 108.97,76.58 108.84,76.45 104.9,76.45 v104.14,77.22 | J1.10 70.45,73.57 v70.61,73.41
P0.11  (via drill 0.3)
  Top 0.254: U1.P27 112.52,67.56 112.52,64.77 v112.78,64.52 | v108.2,65.02 107.95,64.77 99.06,64.77 98.3,65.53 92.96,65.53 92.46,65.02 v86.11,65.02 | v69.6,76.2 v86.11,76.2
  Bottom 0.254: v112.78,64.52 108.71,64.52 v108.2,65.02 | J1.9 69.95,76.55 v69.6,76.2 | v86.11,76.2 v86.11,65.02
P0.12  (via drill 0.25, 0.3)
  Top 0.254: U1.P28 113.33,71.68 v113.54,71.88 | v106.17,67.82 106.17,66.29 105.66,65.79 99.57,65.79 98.81,66.55 89.92,66.55 89.41,66.04 88.14,66.04 v87.63,66.55 | v86.11,77.72 v69.09,77.72
  Bottom 0.254: v113.54,71.88 113.03,71.37 112.27,71.37 111.76,70.87 111.76,68.58 110.49,67.31 107.95,67.31 107.44,67.82 v106.17,67.82 | v87.63,66.55 87.63,76.2 v86.11,77.72 | v69.09,77.72 69.45,78.08 J1.8
P0.13  (via drill 0.3)
  Top 0.254: v110.49,61.98 110.24,61.98 109.47,62.74 88.65,62.74 v88.39,62.48 | v88.39,74.93 v68.33,74.93 | U1.P31 115.17,68.47 115.32,68.33 115.32,65.79 v115.06,65.53
  Bottom 0.254: v110.49,61.98 111.25,62.74 113.79,62.74 114.3,63.25 114.3,65.02 114.81,65.53 v115.06,65.53 | v88.39,62.48 v88.39,74.93 | J1.7 68.95,78.6 68.33,77.98 v68.33,74.93
P0.14  (via drill 0.25, 0.3)
  Top 0.254: U1.P32 114.35,69.42 114.05,69.72 114.05,70.74 v114.17,70.87 | v110.49,62.99 110.24,63.25 89.41,63.25 v89.15,63.5 | v89.15,67.06 88.9,67.31 85.85,67.31 84.84,68.33 68.58,68.33 v68.33,68.07
  Bottom 0.254: v114.17,70.87 114.17,69.6 114.81,68.96 114.81,67.82 114.05,67.06 114.05,66.04 113.79,65.79 113.79,63.75 113.28,63.25 110.74,63.25 v110.49,62.99 | v89.15,63.5 v89.15,67.06 | v68.33,68.07 67.56,68.83 67.56,77.98 68.45,78.86 J1.6
P0.18  (via drill 0.25, 0.3)
  Top 0.254: U1.P36 114.3,72.14 114.3,72.39 113.79,72.9 113.79,74.42 114.81,75.44 v115.32,75.44 | v120.4,72.9 120.4,72.64 122.94,71.12 122.94,70.36 121.92,68.58 J2.6
  Bottom 0.254: v115.32,75.44 115.82,74.93 119.38,72.77 v120.4,72.9
P0.19  (via drill 0.3)
  Top 0.254: U1.P37 116.43,71.27 116.59,71.12 116.59,69.85 116.33,69.6 116.33,69.09 115.82,68.58 115.82,66.42 117.6,64.64 117.6,62.48 v115.82,60.71 | R10.2 50.88,95.51 83.81,95.51 87.12,92.2 v91.69,92.2 | v110.49,60.71 v92.96,60.71
  Bottom 0.254: v110.49,60.71 v115.82,60.71 | v92.96,60.71 92.96,90.93 v91.69,92.2
P0.29  (via drill 0.25, 0.3)
  Top 0.254: U1.P10 110.05,74.61 v110.24,74.55 | v98.3,71.37 96.77,71.37 95.76,70.36 37.34,70.36 36.83,69.85 v30.23,69.85
  Bottom 0.254: v110.24,74.55 110.11,74.55 109.73,74.17 107.7,74.17 107.19,73.66 107.19,71.37 106.17,70.36 99.31,70.36 v98.3,71.37 | JP1.7 30.48,82.86 30.48,74.42 30.23,74.17 v30.23,69.85
P0.30  (via drill 0.3)
  Top 0.254: U1.P11 104.26,74.54 100.84,71.12 100.08,71.12 99.06,72.14 96.77,72.14 95.5,70.87 36.58,70.87 v36.32,70.61
  Bottom 0.254: v36.32,70.61 36.32,77.98 33.27,83.31 33.27,84.33 JP1.5
P0.31  (via drill 0.25, 0.3)
  Top 0.254: U1.P12 110.84,73.63 v110.87,73.66 | v98.04,69.85 97.54,69.34 39.37,69.34 38.86,68.83 38.1,68.83 v37.85,69.09
  Bottom 0.254: v110.87,73.66 108.71,73.66 107.95,72.9 107.95,70.87 106.68,69.6 98.3,69.6 v98.04,69.85 | JP1.3 35.05,85.34 37.86,80.53 37.85,80.51 v37.85,69.09
SW
  pour Top (rank 2, no thermals): 33.53,24.13 35.31,24.13 35.31,24.38 34.8,24.89 34.54,24.89 33.53,25.91 33.53,28.7 30.99,28.7 30.99,25.4 31.5,24.89 33.27,24.89 33.53,24.64
SW5  (via drill 0.25)
  Top 0.254: U1.P38 v115.06,72.64 | v116.33,64.77 116.33,63.59 R5.2
  Bottom 0.254: v116.33,64.77 116.33,66.29 115.32,67.31 115.32,72.39 v115.06,72.64
SWCLK  (via drill 0.3)
  Top 0.254: U1.P43 119.38,73.41 119.63,73.41 119.89,73.66 120.65,73.66 121.16,73.15 121.16,72.9 123.19,71.63 123.44,71.37 123.44,69.85 v123.19,69.34
  Bottom 0.254: v123.19,69.34 121.49,69.34 J2.4
SWDIO  (via drill 0.25)
  Top 0.254: U1.P44 117.33,75.2 v116.59,75.44
  Bottom 0.254: J2.2 121.92,72.39 121.41,72.64 121.16,73.15 120.65,73.66 119.89,73.66 119.38,73.41 117.35,74.68 v116.59,75.44
TOOTH1
  pour Top: 49.28,19.81 49.28,20.49 49.62,21.34 50.29,23.2 50.63,24.05 50.97,24.55 51.31,24.72 51.82,24.72 53.51,24.22 54.53,23.88 55.04,23.54 55.54,22.35 55.21,21.17 54.87,20.32 54.7,19.98 54.19,19.98 53.51,19.81 53.17,19.64 52.67,19.3 52.33,18.97 51.99,18.8 51.34,18.83 50.97,18.97 50.46,19.14 49.45,19.64
TOOTH2
  pour Top: 61.47,16.93 61.64,17.78 62.32,19.64 62.66,20.49 62.83,20.83 63.06,21.05 63.47,21.15 64.4,20.96 66.14,20.48 67.48,20.1 68.34,19.82 68.46,19.47 68.24,18.63 68.11,18.13 68,17.72 67.91,17.27 67.74,16.76 67.57,16.26 67.53,16.22 65.78,16.29 64.91,16.32 63.69,16.39 62.05,16.52 61.69,16.58 61.47,16.76
VBAT  (via drill 0.3, 0.46)
  Top 0.254: IC1.1 34.36,22.42 33.78,21.84 33.27,21.84 v33.02,22.1
  Top 0.305: IC1.4 32.7,24.32 v32.77,24.38
  Top 0.406: J2.7 118.81,67.88 v117.86,68.83
  Top 0.711: v43.43,18.29 43.69,18.29 48.01,13.97 v63.5,13.97
  Top 0.762: v109.73,59.44 88.39,59.44 88.14,59.69 v87.38,59.69 | v63.5,59.18 v63.5,36.07 | v118.36,61.98 118.36,61.72 v116.08,59.44
  Bottom 0.305: v32.77,24.38 32.77,22.35 v33.02,22.1
  Bottom 0.406: v117.86,68.83 117.35,68.33 117.35,65.79 118.36,64.77 v118.36,61.98
  Bottom 0.711: v33.02,22.1 33.78,21.34 33.78,19.3 34.8,18.29 v43.43,18.29
  Bottom 0.762: v116.08,59.44 v109.73,59.44 | v63.5,59.18 86.87,59.18 v87.38,59.69 | v63.5,36.07 v63.5,13.97
  pour Top (no thermals): 27.43,16.26 27.43,23.37 28.19,24.13 32.51,24.13 32.51,24.89 30.99,24.89 30.48,25.4 26.42,25.4 24.89,23.88 24.89,16.26
VIN
  pour Top (no thermals): 40.39,24.13 42.93,24.13 42.93,19.3 37.85,14.22 37.34,14.22 35.31,16 32,16 30.73,17.27 28.19,17.27 28.19,19.05 32.51,19.05 32.51,18.03 37.85,18.03 39.88,20.07 39.88,23.62

### Text on the board
tPlace: EXPANSION
bPlace: #badgelife / JoCo Badge Team: | AI4QR | N5AC | AI6ZU | AI6TK | W5NYV | Special thanks to team AND\!XOR